# EAGLE schematic Motherboard (EAGLE 9.1.0)
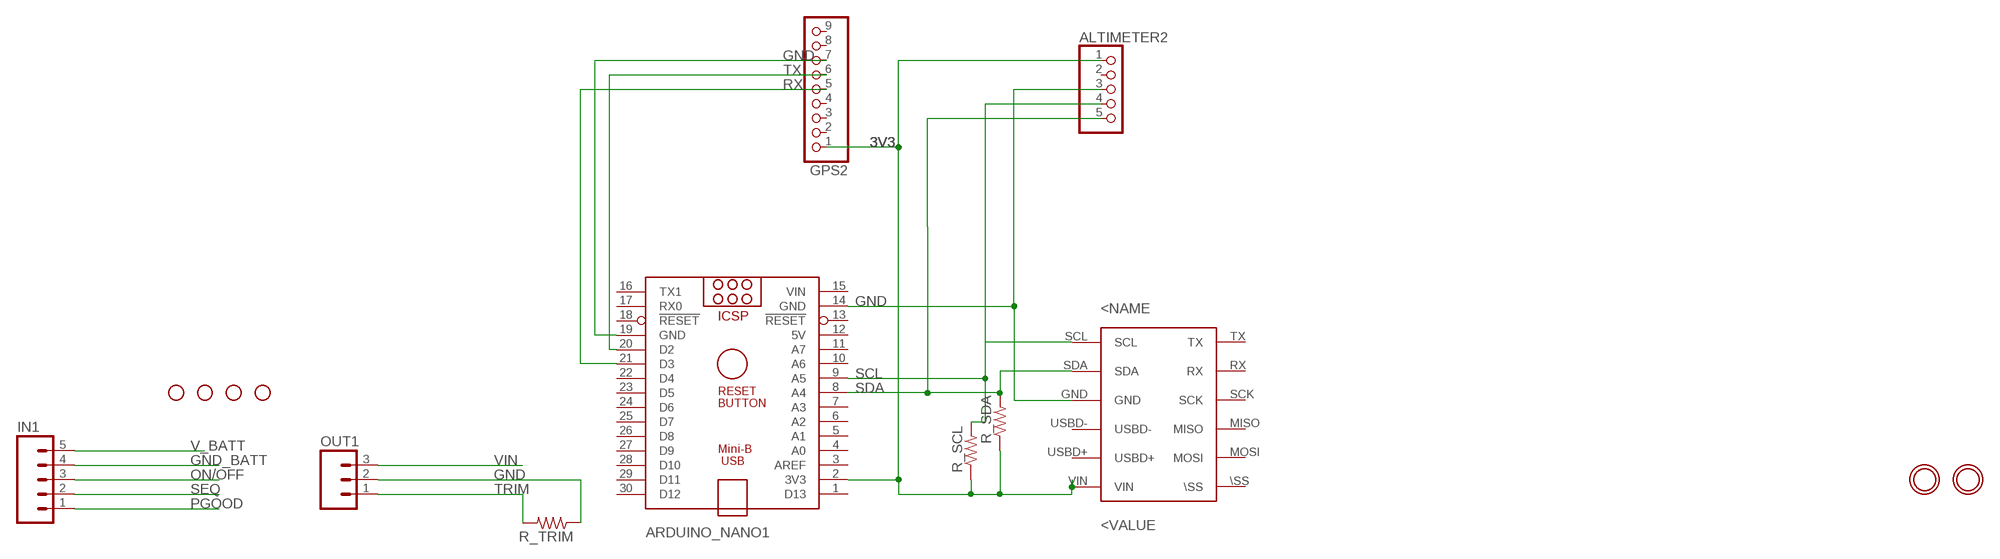
[diagram p0: schematic, sheet 1]

## Parts
ALTIMETER2  HEADER-1X570MIL  [1X05_ROUND_70]
ARDUINO_NANO1  ARDUINO_NANO  [ARDUINO_NANO]
GPS2  HEADER-1X970MIL  [1X09_ROUND_70]
IMU  YOSTLABSIMU  [YOSTLABSIMU]
IN1  M05PTH  [1X05]
OUT1  M03PTH  [1X03]
R_SCL  R-US_R0603  [R0603]
R_SDA  R-US_R0603  [R0603]
R_TRIM  R-US_R0603  [R0603]
U$3  MOUNTINGHOLE2.5  [MOUNTINGHOLE_2.5_PLATED]
U$4  MOUNTINGHOLE2.5  [MOUNTINGHOLE_2.5_PLATED]
U$7  STAND-OFF  [STAND-OFF]
U$8  STAND-OFF  [STAND-OFF]
U$9  STAND-OFF  [STAND-OFF]
U$10  STAND-OFF  [STAND-OFF]

## Nets
3V3: ALTIMETER2.1 ARDUINO_NANO1.2(3V3) GPS2.1 IMU.VIN R_SCL.1 R_SDA.1
GND: ALTIMETER2.3 ARDUINO_NANO1.14(GND) ARDUINO_NANO1.19(GND) GPS2.7 IMU.GND OUT1.2 R_TRIM.1
GND_BATT: IN1.4
ON/OFF: IN1.3
PGOOD: IN1.1
RX: ARDUINO_NANO1.21(D3) GPS2.5
SCL: ALTIMETER2.4 ARDUINO_NANO1.9(A5) IMU.SCL R_SCL.2
SDA: ALTIMETER2.5 ARDUINO_NANO1.8(A4) IMU.SDA R_SDA.2
SEQ: IN1.2
TRIM: OUT1.1 R_TRIM.2
TX: ARDUINO_NANO1.20(D2) GPS2.6
V_BATT: IN1.5
VIN: OUT1.3
Unconnected: ALTIMETER2.2 ARDUINO_NANO1.1(D13) ARDUINO_NANO1.3(AREF) ARDUINO_NANO1.4(A0) ARDUINO_NANO1.5(A1) ARDUINO_NANO1.6(A2) ARDUINO_NANO1.7(A3) ARDUINO_NANO1.10(A6) ARDUINO_NANO1.11(A7) ARDUINO_NANO1.13(!RESET) ARDUINO_NANO1.16(TX1) ARDUINO_NANO1.17(RX0) ARDUINO_NANO1.18(!RESET) ARDUINO_NANO1.22(D4) ARDUINO_NANO1.23(D5) ARDUINO_NANO1.24(D6) ARDUINO_NANO1.25(D7) ARDUINO_NANO1.26(D8) ARDUINO_NANO1.27(D9) ARDUINO_NANO1.28(D10) ARDUINO_NANO1.29(D11) ARDUINO_NANO1.30(D12) GPS2.2 GPS2.3 GPS2.4 GPS2.8 GPS2.9 IMU.\SS IMU.MISO IMU.MOSI IMU.RX IMU.SCK IMU.TX IMU.USBD+ IMU.USBD-

## Power pins joined to a net without a drawn wire
5V: ARDUINO_NANO1.12(5V)
VIN: ARDUINO_NANO1.15(VIN)

## Library data of the parts
ALTIMETER2 = microbuilder:HEADER-1X5: PIN HEADER
ARDUINO_NANO1 = ArduinoNanoV30:ARDUINO_NANO: Arduino Nano V3.0 Overview: The Arduino Nano is a small, complete, and breadboard-friendly board based on the ATmega328 (Arduino Nano 3.x) or ATmega168 (Arduino Nano 2.x). It has more or less the same functionality of the Arduino Duemilanove, but in a different package. It lacks only a DC power jack, and works with a Mini-B USB cable instead of a standard one. The Nano was designed and is being produced by Gravitech. Specifications: Microcontroller Atmel ATmega168 or ATmega328 Operating Voltage (logic level) 5 V Input Voltage (recommended) 7-12 V Input Voltage (limits) 6-20 V Digital I/O Pins 14 (of which 6 provide PWM output) Analog Input Pins 8 DC Current per I/O Pin 40 mA Flash Memory 16 KB (ATmega168) or 32 KB (ATmega328) of which 2 KB used by bootloader SRAM 1 KB (ATmega168) or 2 KB (ATmega328) EEPROM 512 bytes (ATmega168) or 1 KB (ATmega328) Clock Speed 16 MHz Dimensions 0.73" x 1.70" Length 45 mm Width 18 mm Weigth 5 g Power: The Arduino Nano can be powered via the Mini-B USB connection, 6-20V unregulated external power supply (pin 30), or 5V regulated external power supply (pin 27). The power source is automatically selected to the highest voltage source. Memory: The ATmega168 has 16 KB of flash memory for storing code (of which 2 KB is used for the bootloader); the ATmega328 has 32 KB, (also with 2 KB used for the bootloader). The ATmega168 has 1 KB of SRAM and 512 bytes of EEPROM (which can be read and written with the EEPROM library); the ATmega328 has 2 KB of SRAM and 1 KB of EEPROM. Input and Output: Each of the 14 digital pins on the Nano can be used as an input or output, using pinMode(), digitalWrite(), and digitalRead() functions. They operate at 5 volts. Each pin can provide or receive a maximum of 40 mA and has an internal pull-up resistor (disconnected by default) of 20-50 kOhms. In addition, some pins have specialized functions. Visit Arduino - ArduinoBoardNano <https://www.arduino.cc/en/Main/ArduinoBoardNano>
GPS2 = microbuilder:HEADER-1X9: PIN HEADER
IMU = YOST LABS IMU:YOSTLABSIMU
IN1 = SparkFun:M05: Header 5 Standard 5-pin 0.1" header. Use with straight break away headers (SKU : PRT-00116), right angle break away headers (PRT-00553), swiss pins (PRT-00743), machine pins (PRT-00117), and female headers (PRT-00115). Molex polarized connector foot print use with SKU : PRT-08230 with associated crimp pins and housings.
OUT1 = SparkFun:M03: Header 3 Standard 3-pin 0.1" header. Use with straight break away headers (SKU : PRT-00116), right angle break away headers (PRT-00553), swiss pins (PRT-00743), machine pins (PRT-00117), and female headers (PRT-00115). Molex polarized connector foot print use with SKU : PRT-08232 with associated crimp pins and housings.
R_SCL R_SDA R_TRIM = rcl:R-US_: RESISTOR, American symbol; SPICEPREFIX: R
U$3 U$4 = microbuilder:MOUNTINGHOLE: Mounting Hole For #2 screws (0.086"/2.18mm width, 0.094"/2.4mm hole) use 2.5mm; BOM: EXCLUDE
U$7-U$10 = SparkFun:STAND-OFF: Stand Off This is the mechanical footprint for a #4 phillips button head screw. Use the keepout ring to avoid running the screw head into surrounding components. SKU : PRT-00447